# Altium schematic sheet Input - Pedals.SchDoc
size A; SheetNumber: 10; SheetTotal: 11
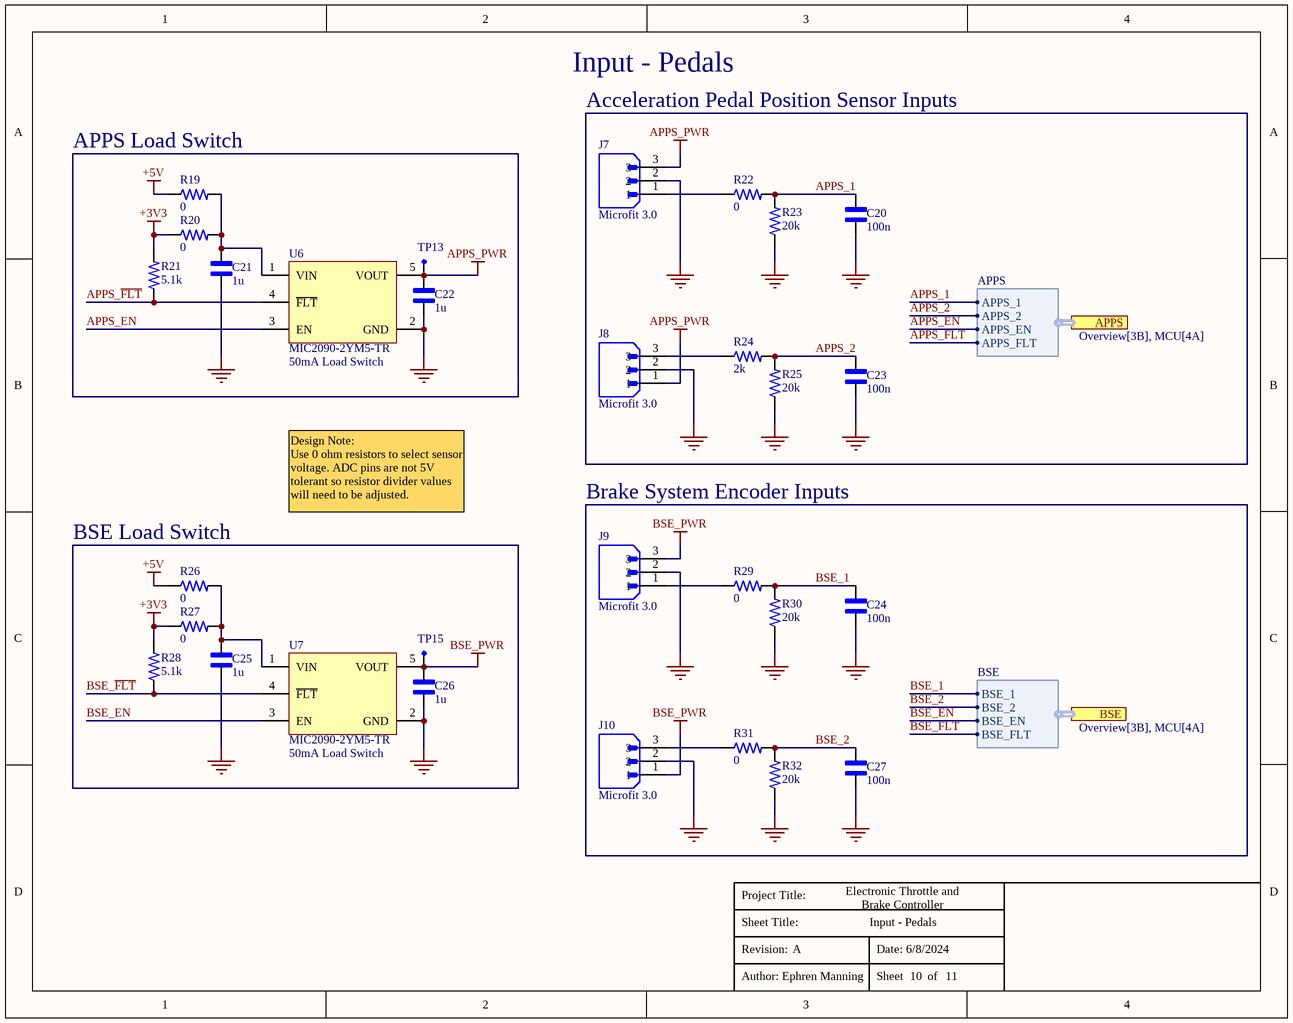
[diagram p0: Input - Pedals.SchDoc]

## Parts
C20  100n  [CAP_0402-Footprint-1]
C21  1u  [CAP_0402-Footprint-1]
C22  1u  [CAP_0402-Footprint-1]
C23  100n  [CAP_0402-Footprint-1]
C24  100n  [CAP_0402-Footprint-1]
C25  1u  [CAP_0402-Footprint-1]
C26  1u  [CAP_0402-Footprint-1]
C27  100n  [CAP_0402-Footprint-1]
J7  Microfit 3.0  [MOLEX_436500316]
J8  Microfit 3.0  [MOLEX_436500316]
J9  Microfit 3.0  [MOLEX_436500316]
J10  Microfit 3.0  [MOLEX_436500316]
R19  0  [RES_0402-Footprint-1]
R20  0  [RES_0402-Footprint-1]
R21  5.1k  [RES_0402-Footprint-1]
R22  0  [RES_0402-Footprint-1]
R23  20k  [RES_0402-Footprint-1]
R24  2k  [RES_0402-Footprint-1]
R25  20k  [RES_0402-Footprint-1]
R26  0  [RES_0402-Footprint-1]
R27  0  [RES_0402-Footprint-1]
R28  5.1k  [RES_0402-Footprint-1]
R29  0  [RES_0402-Footprint-1]
R30  20k  [RES_0402-Footprint-1]
R31  0  [RES_0402-Footprint-1]
R32  20k  [RES_0402-Footprint-1]
TP13  SMD Testpoint  [SMD Testpoint-Footprint-1]  (value not drawn)
TP15  SMD Testpoint  [SMD Testpoint-Footprint-1]  (value not drawn)
U6  MIC2090-2YM5-TR  [SOT95P275X110-5N]
U7  MIC2090-2YM5-TR  [SOT95P275X110-5N]

## Blocks framed on the sheet
Acceleration Pedal Position Sensor Inputs: C20 C23 J7 J8 R22-R25
APPS Load Switch: C21 C22 R19-R21 TP13 U6
Brake System Encoder Inputs: C24 C27 J9 J10 R29-R32
BSE Load Switch: C25 C26 R26-R28 TP15 U7

## Ports
APPS (harness APPS, see Overview[3B], MCU[4A]), BSE (harness BSE, see Overview[3B], MCU[4A])

## Harnesses
BSE: BSE_1, BSE_2, BSE_EN, BSE_FLT
APPS: APPS_1, APPS_2, APPS_EN, APPS_FLT

## Nets
+3V3: R20.1 R21.2 R27.1 R28.2
+5V: R19.1 R26.1
APPS_PWR: C22.2 J7.3 J8.1 TP13.1 U6.5(VOUT)
BSE_PWR: C26.2 J9.3 J10.1 TP15.1 U7.5(VOUT)
GND: C20.1 C21.1 C22.1 C23.1 C24.1 C25.1 C26.1 C27.1 J7.2 J8.2 J9.2 J10.2 R23.1 R25.1 R30.1 R32.1 U6.2(GND) U7.2(GND)
APPS_1: C20.2 R22.2 R23.2 ; port APPS.APPS_1
APPS_2: C23.2 R24.2 R25.2 ; port APPS.APPS_2
APPS_EN: U6.3(EN) ; port APPS.APPS_EN
APPS_~{FLT}: R21.1 U6.4(~{FLT}) ; port APPS.APPS_FLT
BSE_1: C24.2 R29.2 R30.2 ; port BSE.BSE_1
BSE_2: C27.2 R31.2 R32.2 ; port BSE.BSE_2
BSE_EN: U7.3(EN) ; port BSE.BSE_EN
BSE_~{FLT}: R28.1 U7.4(~{FLT}) ; port BSE.BSE_FLT
NetC21_2: C21.2 R19.2 R20.2 U6.1(VIN)
NetC25_2: C25.2 R26.2 R27.2 U7.1(VIN)
NetJ7_1: J7.1 R22.1
NetJ8_3: J8.3 R24.1
NetJ9_1: J9.1 R29.1
NetJ10_3: J10.3 R31.1

## Notes on the sheet
- Input - Pedals
- (near U6) 50mA Load Switch
- Design Note:
  Use 0 ohm resistors to select sensor voltage. ADC pins are not 5V tolerant so resistor divider values will need to be adjusted.
- (near U7) 50mA Load Switch
- Electronic Throttle and
  Brake Controller
- A
- 6/8/2024
- Ephren Manning
- 10
- 11
- Project Title:
- Sheet Title:
- Revision:
- Date:
- Author:
- Sheet        of

## Library data of the parts
C20 C23 C24 C27 = CMP-00066-3: 100nF 10V 10% 0402 CAP; Manufacturer Part Number 1: CL05B104KP5NNNC; Manufacturer 1: Samsung Electro-Mechanics; Digikey Part Number: 1276-1002-1-ND
C21 C22 C25 C26 = CMP-00068-3: 1uF 10V 10% 0402 CAP; Manufacturer 1: Samsung Electro-Mechanics; Manufacturer Part Number 1: CL05A105KP5NNNC; Digikey Part Number: 1276-1076-1-ND
J7-J10 = CMP-085-000001-2: 1x3 Gold Microfit; Manufacturer 1: Molex; Manufacturer Part Number 1: 436500316; Digikey Part Number: WM1923-ND
R19 R20 R22 R26 R27 R29 R31 = CMP-00070-1: 0 Ohm 1/16W 0402 Resistor; Manufacturer 1: YAGEO; Manufacturer Part Number 1: RC0402JR-070RL; Digikey Part Number: 311-0.0JRCT-ND
R21 R28 = CMP-00074-1: 5.1k 1% 1/16W 0402 Resistor; Manufacturer 1: YAGEO; Manufacturer Part Number 1: RC0402FR-075K1L; Digikey Part Number: 311-5.10KLRCT-ND
R23 R25 R30 R32 = CMP-00081-1: 20k 0.1% 1/16W 0402 Thin Film; Manufacturer 1: YAGEO; Manufacturer Part Number 1: RT0402BRD0720KL; Digikey Part Number: YAG1388CT-ND
R24 = CMP-00080-1: 2k 0.1% 1/16W 0402 Thin Film; Manufacturer 1: YAGEO; Manufacturer Part Number 1: RT0402BRD072KL; Digikey Part Number: YAG2303CT-ND
TP13 TP15 = CMP-00095-4: Flat 50x50mil Test Point
U6 U7 = CMP-00085-1: 50mA Load Switch w/ Overcurrent Protection; Manufacturer 1: Microchip Technology; Digikey Part Number: 576-3964-1-ND; Manufacturer Part Number 1: MIC2090-2YM5-TR